# Altium schematic sheet 06-ModuleControls.SchDoc
size A
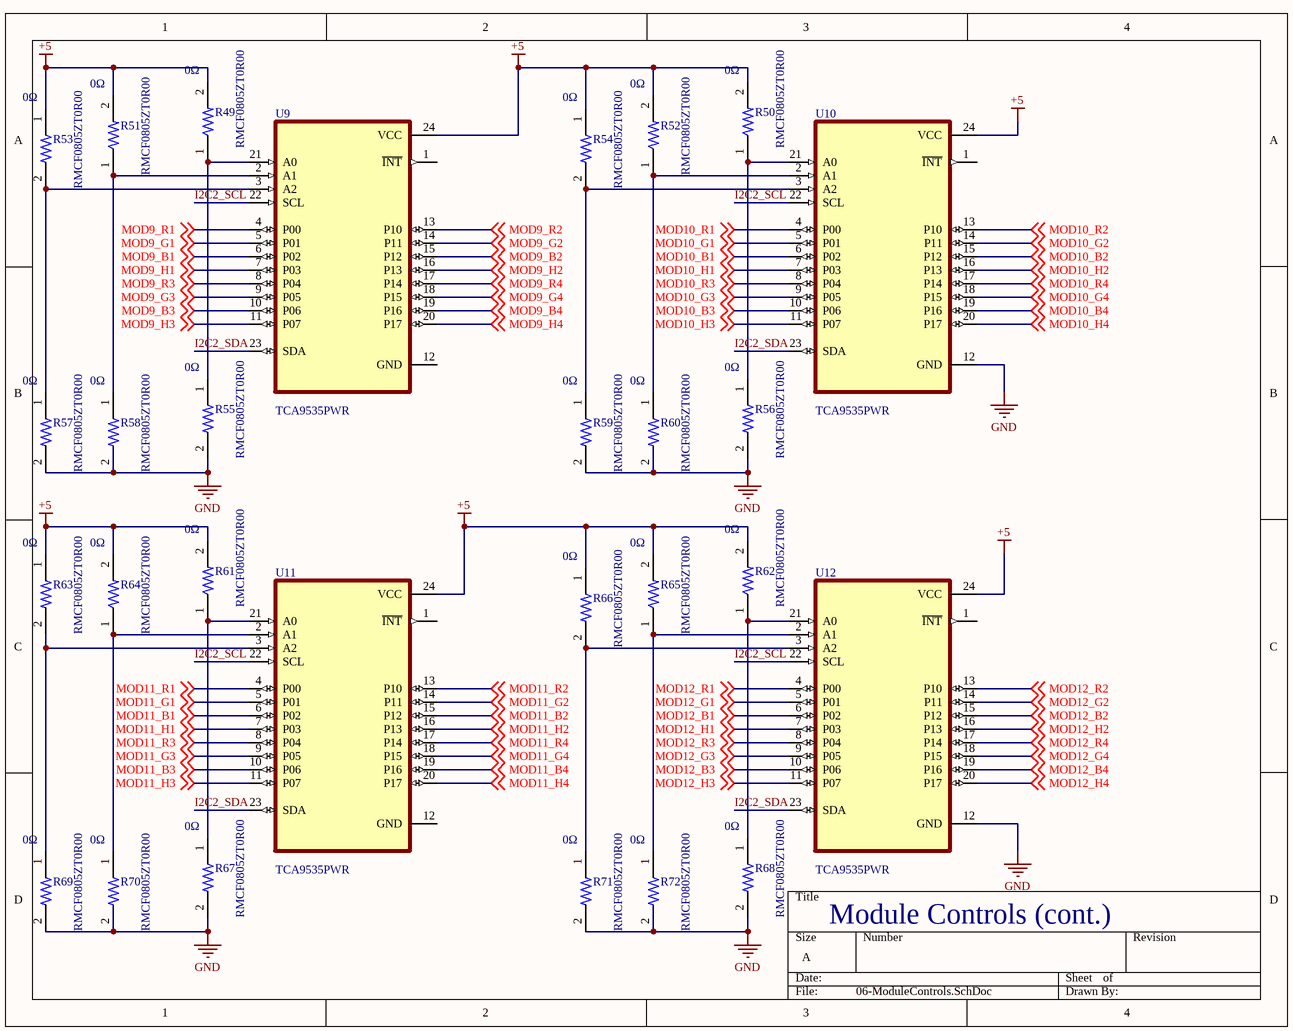
[diagram p0: 06-ModuleControls.SchDoc]

## Parts
R49  RMCF0805ZT0R00  Resitance: 0Ω  [RESC2012X60N]
R50  RMCF0805ZT0R00  Resitance: 0Ω  [RESC2012X60N]
R51  RMCF0805ZT0R00  Resitance: 0Ω  [RESC2012X60N]
R52  RMCF0805ZT0R00  Resitance: 0Ω  [RESC2012X60N]
R53  RMCF0805ZT0R00  Resitance: 0Ω  [RESC2012X60N]
R54  RMCF0805ZT0R00  Resitance: 0Ω  [RESC2012X60N]
R55  RMCF0805ZT0R00  Resitance: 0Ω  [RESC2012X60N]
R56  RMCF0805ZT0R00  Resitance: 0Ω  [RESC2012X60N]
R57  RMCF0805ZT0R00  Resitance: 0Ω  [RESC2012X60N]
R58  RMCF0805ZT0R00  Resitance: 0Ω  [RESC2012X60N]
R59  RMCF0805ZT0R00  Resitance: 0Ω  [RESC2012X60N]
R60  RMCF0805ZT0R00  Resitance: 0Ω  [RESC2012X60N]
R61  RMCF0805ZT0R00  Resitance: 0Ω  [RESC2012X60N]
R62  RMCF0805ZT0R00  Resitance: 0Ω  [RESC2012X60N]
R63  RMCF0805ZT0R00  Resitance: 0Ω  [RESC2012X60N]
R64  RMCF0805ZT0R00  Resitance: 0Ω  [RESC2012X60N]
R65  RMCF0805ZT0R00  Resitance: 0Ω  [RESC2012X60N]
R66  RMCF0805ZT0R00  Resitance: 0Ω  [RESC2012X60N]
R67  RMCF0805ZT0R00  Resitance: 0Ω  [RESC2012X60N]
R68  RMCF0805ZT0R00  Resitance: 0Ω  [RESC2012X60N]
R69  RMCF0805ZT0R00  Resitance: 0Ω  [RESC2012X60N]
R70  RMCF0805ZT0R00  Resitance: 0Ω  [RESC2012X60N]
R71  RMCF0805ZT0R00  Resitance: 0Ω  [RESC2012X60N]
R72  RMCF0805ZT0R00  Resitance: 0Ω  [RESC2012X60N]
U9  TCA9535PWR  [SOP65P640X120-24N]
U10  TCA9535PWR  [SOP65P640X120-24N]
U11  TCA9535PWR  [SOP65P640X120-24N]
U12  TCA9535PWR  [SOP65P640X120-24N]

## Nets
+5: R49.2 R50.2 R51.2 R52.2 R53.1 R54.1 R61.2 R62.2 R63.1 R64.2 R65.2 R66.1 U9.24(VCC) U10.24(VCC) U11.24(VCC) U12.24(VCC)
GND: R55.2 R56.2 R57.2 R58.2 R59.2 R60.2 R67.2 R68.2 R69.2 R70.2 R71.2 R72.2 U10.12(GND) U12.12(GND)
I2C2_SCL: U9.22(SCL) U10.22(SCL) U11.22(SCL) U12.22(SCL)
I2C2_SDA: U9.23(SDA) U10.23(SDA) U11.23(SDA) U12.23(SDA)
MOD9_B1: U9.6(P02) ; off-sheet MOD9_B1
MOD9_B2: U9.15(P12) ; off-sheet MOD9_B2
MOD9_B3: U9.10(P06) ; off-sheet MOD9_B3
MOD9_B4: U9.19(P16) ; off-sheet MOD9_B4
MOD9_G1: U9.5(P01) ; off-sheet MOD9_G1
MOD9_G2: U9.14(P11) ; off-sheet MOD9_G2
MOD9_G3: U9.9(P05) ; off-sheet MOD9_G3
MOD9_G4: U9.18(P15) ; off-sheet MOD9_G4
MOD9_H1: U9.7(P03) ; off-sheet MOD9_H1
MOD9_H2: U9.16(P13) ; off-sheet MOD9_H2
MOD9_H3: U9.11(P07) ; off-sheet MOD9_H3
MOD9_H4: U9.20(P17) ; off-sheet MOD9_H4
MOD9_R1: U9.4(P00) ; off-sheet MOD9_R1
MOD9_R2: U9.13(P10) ; off-sheet MOD9_R2
MOD9_R3: U9.8(P04) ; off-sheet MOD9_R3
MOD9_R4: U9.17(P14) ; off-sheet MOD9_R4
MOD10_B1: U10.6(P02) ; off-sheet MOD10_B1
MOD10_B2: U10.15(P12) ; off-sheet MOD10_B2
MOD10_B3: U10.10(P06) ; off-sheet MOD10_B3
MOD10_B4: U10.19(P16) ; off-sheet MOD10_B4
MOD10_G1: U10.5(P01) ; off-sheet MOD10_G1
MOD10_G2: U10.14(P11) ; off-sheet MOD10_G2
MOD10_G3: U10.9(P05) ; off-sheet MOD10_G3
MOD10_G4: U10.18(P15) ; off-sheet MOD10_G4
MOD10_H1: U10.7(P03) ; off-sheet MOD10_H1
MOD10_H2: U10.16(P13) ; off-sheet MOD10_H2
MOD10_H3: U10.11(P07) ; off-sheet MOD10_H3
MOD10_H4: U10.20(P17) ; off-sheet MOD10_H4
MOD10_R1: U10.4(P00) ; off-sheet MOD10_R1
MOD10_R2: U10.13(P10) ; off-sheet MOD10_R2
MOD10_R3: U10.8(P04) ; off-sheet MOD10_R3
MOD10_R4: U10.17(P14) ; off-sheet MOD10_R4
MOD11_B1: U11.6(P02) ; off-sheet MOD11_B1
MOD11_B2: U11.15(P12) ; off-sheet MOD11_B2
MOD11_B3: U11.10(P06) ; off-sheet MOD11_B3
MOD11_B4: U11.19(P16) ; off-sheet MOD11_B4
MOD11_G1: U11.5(P01) ; off-sheet MOD11_G1
MOD11_G2: U11.14(P11) ; off-sheet MOD11_G2
MOD11_G3: U11.9(P05) ; off-sheet MOD11_G3
MOD11_G4: U11.18(P15) ; off-sheet MOD11_G4
MOD11_H1: U11.7(P03) ; off-sheet MOD11_H1
MOD11_H2: U11.16(P13) ; off-sheet MOD11_H2
MOD11_H3: U11.11(P07) ; off-sheet MOD11_H3
MOD11_H4: U11.20(P17) ; off-sheet MOD11_H4
MOD11_R1: U11.4(P00) ; off-sheet MOD11_R1
MOD11_R2: U11.13(P10) ; off-sheet MOD11_R2
MOD11_R3: U11.8(P04) ; off-sheet MOD11_R3
MOD11_R4: U11.17(P14) ; off-sheet MOD11_R4
MOD12_B1: U12.6(P02) ; off-sheet MOD12_B1
MOD12_B2: U12.15(P12) ; off-sheet MOD12_B2
MOD12_B3: U12.10(P06) ; off-sheet MOD12_B3
MOD12_B4: U12.19(P16) ; off-sheet MOD12_B4
MOD12_G1: U12.5(P01) ; off-sheet MOD12_G1
MOD12_G2: U12.14(P11) ; off-sheet MOD12_G2
MOD12_G3: U12.9(P05) ; off-sheet MOD12_G3
MOD12_G4: U12.18(P15) ; off-sheet MOD12_G4
MOD12_H1: U12.7(P03) ; off-sheet MOD12_H1
MOD12_H2: U12.16(P13) ; off-sheet MOD12_H2
MOD12_H3: U12.11(P07) ; off-sheet MOD12_H3
MOD12_H4: U12.20(P17) ; off-sheet MOD12_H4
MOD12_R1: U12.4(P00) ; off-sheet MOD12_R1
MOD12_R2: U12.13(P10) ; off-sheet MOD12_R2
MOD12_R3: U12.8(P04) ; off-sheet MOD12_R3
MOD12_R4: U12.17(P14) ; off-sheet MOD12_R4
NetR49_1: R49.1 R55.1 U9.21(A0)
NetR50_1: R50.1 R56.1 U10.21(A0)
NetR51_1: R51.1 R58.1 U9.2(A1)
NetR52_1: R52.1 R60.1 U10.2(A1)
NetR53_2: R53.2 R57.1 U9.3(A2)
NetR54_2: R54.2 R59.1 U10.3(A2)
NetR61_1: R61.1 R67.1 U11.21(A0)
NetR62_1: R62.1 R68.1 U12.21(A0)
NetR63_2: R63.2 R69.1 U11.3(A2)
NetR64_1: R64.1 R70.1 U11.2(A1)
NetR65_1: R65.1 R72.1 U12.2(A1)
NetR66_2: R66.2 R71.1 U12.3(A2)

Not connected (* = marked no-connect by the designer): U9 1(~{INT}) 12(GND); U10 1(~{INT}); U11 1(~{INT}) 12(GND); U12 1(~{INT})

## Notes on the sheet
- Module Controls (cont.)

## Library data of the parts
R49-R72 = RMCF0805ZT0R00: 0 Ohms Jumper 0.125W, 1/8W Chip Resistor 0805 (2012 Metric) Automotive AEC-Q200 Thick Film; MF: Stackpole Electronics; DigiKey-Purchase-URL: https://snapeda.com/shop?store=DigiKey&id=492501; Package: 0805 Stackpole Electronics; Availability: Unavailable; MP: RMCF0805ZT0R00; SnapEDA_Link: https://www.snapeda.com/parts/RMCF0805ZT0R00/Stackpole%20Electronics%20Inc/view-part/492501/?ref=snap; Price: None; Parameter 1: *
U9-U12 = TCA9535PWR: Remote 16-Bit I2C and SMBus, Low-Power I/O Expander With Interrupt Output and Config Registers 24-TSSOP -40 to 85; MF: Texas Instruments; Texas_Instruments-Purchase-URL: https://snapeda.com/shop?store=Texas+Instruments&id=1237891; SnapEDA_Link: https://www.snapeda.com/parts/TCA9535PWR/Texas%20Instruments/view-part/1237891/?ref=snap; Availability: Good; Price: None; MP: TCA9535PWR; DigiKey-Purchase-URL: https://snapeda.com/shop?store=DigiKey&id=1237891; Package: TSSOP-24 Texas Instruments; Mouser-Purchase-URL: https://snapeda.com/shop?store=Mouser&id=1237891; Arrow_Electronics-Purchase-URL: https://snapeda.com/shop?store=Arrow+Electronics&id=1237891; Value: *